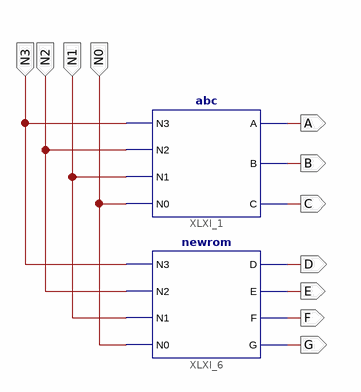
[diagram p0: schematic sheet 1]
// Xilinx ISE schematic newcombined.sch (spartan3e) as structural Verilog: 2 symbols, 11 ports
module newcombined (
  input  N0,
  input  N1,
  input  N2,
  input  N3,
  output A,
  output B,
  output C,
  output D,
  output E,
  output F,
  output G
);

  abc XLXI_1 (.N3(N3), .N2(N2), .N1(N1), .N0(N0), .A(A), .B(B), .C(C));
  newrom XLXI_6 (.N3(N3), .N2(N2), .N1(N1), .N0(N0), .D(D), .E(E), .F(F), .G(G));
endmodule
